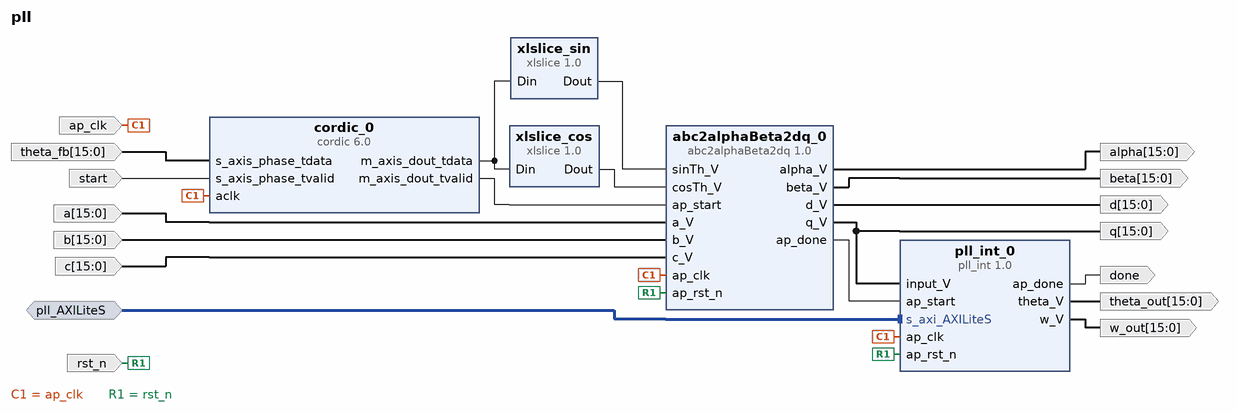
[diagram p0: block diagram of the top level]
# Vivado block design pll, xc7z010clg400-1, Vivado 2017.2
create_bd_design pll

create_bd_intf_port -mode Slave -vlnv xilinx.com:interface:aximm_rtl:1.0 pll_AXILiteS
set_property -dict [list \
  CONFIG.DATA_WIDTH 32 \
  CONFIG.PROTOCOL AXI4LITE \
  CONFIG.ID_WIDTH 0 \
  CONFIG.ADDR_WIDTH 16 \
  CONFIG.AWUSER_WIDTH 0 \
  CONFIG.ARUSER_WIDTH 0 \
  CONFIG.WUSER_WIDTH 0 \
  CONFIG.RUSER_WIDTH 0 \
  CONFIG.BUSER_WIDTH 0 \
  CONFIG.READ_WRITE_MODE READ_WRITE \
  CONFIG.HAS_BURST 0 \
  CONFIG.HAS_LOCK 0 \
  CONFIG.HAS_PROT 0 \
  CONFIG.HAS_CACHE 0 \
  CONFIG.HAS_QOS 0 \
  CONFIG.HAS_REGION 0 \
  CONFIG.HAS_WSTRB 1 \
  CONFIG.HAS_BRESP 1 \
  CONFIG.HAS_RRESP 1 \
  CONFIG.SUPPORTS_NARROW_BURST 0 \
  CONFIG.NUM_READ_OUTSTANDING 1 \
  CONFIG.NUM_WRITE_OUTSTANDING 1 \
  CONFIG.MAX_BURST_LENGTH 1 \
  CONFIG.CLK_DOMAIN top_bd_processing_system7_0_1_FCLK_CLK0 \
  CONFIG.NUM_READ_THREADS 1 \
  CONFIG.NUM_WRITE_THREADS 1 \
  CONFIG.RUSER_BITS_PER_BYTE 0 \
  CONFIG.WUSER_BITS_PER_BYTE 0 \
] [get_bd_intf_ports pll_AXILiteS]
create_bd_port -dir I -from 15 -to 0 -type data a
set_property -dict [list \
  CONFIG.LAYERED_METADATA {xilinx.com:interface:datatypes:1.0 {DATA {datatype {name {attribs {resolve_type immediate dependency {} format string minimum {} maximum {}} value {}} bitwidth {attribs {resolve_type immediate dependency {} format long minimum {} maximum {}} value 16} bitoffset {attribs {resolve_type immediate dependency {} format long minimum {} maximum {}} value 0} real {fixed {fractwidth {attribs {resolve_type immediate dependency {} format long minimum {} maximum {}} value 12} signed {attribs {resolve_type immediate dependency {} format bool minimum {} maximum {}} value true}}}}}}} \
] [get_bd_ports a]
create_bd_port -dir O -from 15 -to 0 -type data alpha
create_bd_port -dir I -type clk ap_clk
set_property -dict {CONFIG.CLK_DOMAIN top_bd_processing_system7_0_1_FCLK_CLK0} [get_bd_ports ap_clk]
create_bd_port -dir I -from 15 -to 0 -type data b
set_property -dict [list \
  CONFIG.LAYERED_METADATA {xilinx.com:interface:datatypes:1.0 {DATA {datatype {name {attribs {resolve_type immediate dependency {} format string minimum {} maximum {}} value {}} bitwidth {attribs {resolve_type immediate dependency {} format long minimum {} maximum {}} value 16} bitoffset {attribs {resolve_type immediate dependency {} format long minimum {} maximum {}} value 0} real {fixed {fractwidth {attribs {resolve_type immediate dependency {} format long minimum {} maximum {}} value 12} signed {attribs {resolve_type immediate dependency {} format bool minimum {} maximum {}} value true}}}}}}} \
] [get_bd_ports b]
create_bd_port -dir O -from 15 -to 0 -type data beta
create_bd_port -dir I -from 15 -to 0 -type data c
set_property -dict [list \
  CONFIG.LAYERED_METADATA {xilinx.com:interface:datatypes:1.0 {DATA {datatype {name {attribs {resolve_type immediate dependency {} format string minimum {} maximum {}} value {}} bitwidth {attribs {resolve_type immediate dependency {} format long minimum {} maximum {}} value 16} bitoffset {attribs {resolve_type immediate dependency {} format long minimum {} maximum {}} value 0} real {fixed {fractwidth {attribs {resolve_type immediate dependency {} format long minimum {} maximum {}} value 12} signed {attribs {resolve_type immediate dependency {} format bool minimum {} maximum {}} value true}}}}}}} \
] [get_bd_ports c]
create_bd_port -dir O -from 15 -to 0 -type data d
create_bd_port -dir O done
create_bd_port -dir O -from 15 -to 0 -type data q
create_bd_port -dir I -type rst rst_n
create_bd_port -dir I start
create_bd_port -dir I -from 15 -to 0 theta_fb
create_bd_port -dir O -from 15 -to 0 -type data theta_out
create_bd_port -dir O -from 15 -to 0 -type data w_out

create_bd_cell -type ip -vlnv PSC:hls:abc2alphaBeta2dq:1.0 abc2alphaBeta2dq_0
create_bd_cell -type ip -vlnv xilinx.com:ip:cordic:6.0 cordic_0
set_property -dict [list \
  CONFIG.Functional_Selection Sin_and_Cos \
  CONFIG.Architectural_Configuration Word_Serial \
  CONFIG.Pipelining_Mode Optimal \
  CONFIG.Data_Format SignedFraction \
] [get_bd_cells cordic_0]
create_bd_cell -type ip -vlnv PSC:hls:pll_int:1.0 pll_int_0
create_bd_cell -type ip -vlnv xilinx.com:ip:xlslice:1.0 xlslice_cos
set_property -dict {CONFIG.DIN_FROM 15 CONFIG.DOUT_WIDTH 16} [get_bd_cells xlslice_cos]
create_bd_cell -type ip -vlnv xilinx.com:ip:xlslice:1.0 xlslice_sin
set_property -dict {CONFIG.DIN_TO 16 CONFIG.DIN_FROM 31 CONFIG.DOUT_WIDTH 16} [get_bd_cells xlslice_sin]

# ---- connections ----

connect_bd_intf_net [get_bd_intf_ports pll_AXILiteS] [get_bd_intf_pins pll_int_0/s_axi_AXILiteS]
connect_bd_net [get_bd_pins cordic_0/m_axis_dout_tdata] [get_bd_pins xlslice_cos/Din] [get_bd_pins xlslice_sin/Din]
connect_bd_net [get_bd_ports a] [get_bd_pins abc2alphaBeta2dq_0/a_V]
connect_bd_net [get_bd_pins abc2alphaBeta2dq_0/alpha_V] [get_bd_ports alpha]
connect_bd_net [get_bd_pins abc2alphaBeta2dq_0/ap_done] [get_bd_pins pll_int_0/ap_start]
connect_bd_net [get_bd_pins abc2alphaBeta2dq_0/beta_V] [get_bd_ports beta]
connect_bd_net [get_bd_pins abc2alphaBeta2dq_0/d_V] [get_bd_ports d]
connect_bd_net [get_bd_pins abc2alphaBeta2dq_0/q_V] [get_bd_ports q] [get_bd_pins pll_int_0/input_V]
connect_bd_net [get_bd_ports ap_clk] [get_bd_pins abc2alphaBeta2dq_0/ap_clk] [get_bd_pins cordic_0/aclk] [get_bd_pins pll_int_0/ap_clk]
connect_bd_net -net ap_rst_n_1 [get_bd_ports rst_n] [get_bd_pins abc2alphaBeta2dq_0/ap_rst_n] [get_bd_pins pll_int_0/ap_rst_n]
connect_bd_net [get_bd_ports b] [get_bd_pins abc2alphaBeta2dq_0/b_V]
connect_bd_net [get_bd_ports c] [get_bd_pins abc2alphaBeta2dq_0/c_V]
connect_bd_net [get_bd_pins cordic_0/m_axis_dout_tvalid] [get_bd_pins abc2alphaBeta2dq_0/ap_start]
connect_bd_net -net pll_int_1_ap_done [get_bd_pins pll_int_0/ap_done] [get_bd_ports done]
connect_bd_net -net pll_int_1_theta_V [get_bd_pins pll_int_0/theta_V] [get_bd_ports theta_out]
connect_bd_net -net pll_int_1_w_V [get_bd_pins pll_int_0/w_V] [get_bd_ports w_out]
connect_bd_net -net s_axis_phase_tdata_1 [get_bd_ports theta_fb] [get_bd_pins cordic_0/s_axis_phase_tdata]
connect_bd_net -net s_axis_phase_tvalid_1 [get_bd_ports start] [get_bd_pins cordic_0/s_axis_phase_tvalid]
connect_bd_net [get_bd_pins xlslice_cos/Dout] [get_bd_pins abc2alphaBeta2dq_0/cosTh_V]
connect_bd_net [get_bd_pins xlslice_sin/Dout] [get_bd_pins abc2alphaBeta2dq_0/sinTh_V]

# ---- address map ----
assign_bd_address -offset 0x0000 -range 4K -target_address_space [get_bd_addr_spaces pll_AXILiteS] [get_bd_addr_segs pll_int_0/s_axi_AXILiteS/Reg]

validate_bd_design
save_bd_design
